# Altium schematic sheet Sheet2.SchDoc
size A
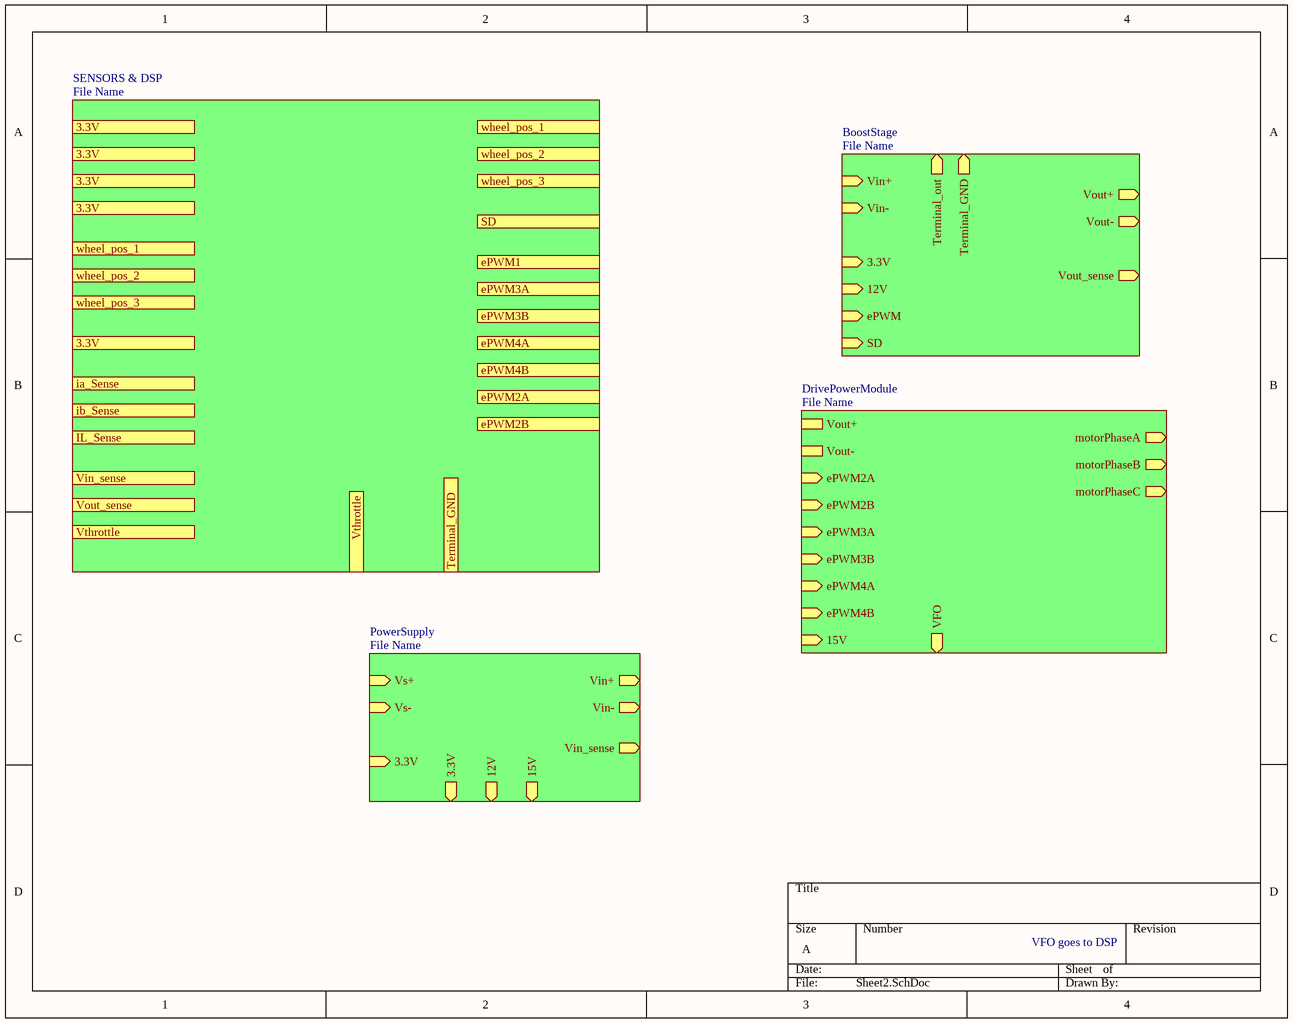
[diagram p0: Sheet2.SchDoc]

## Sub-sheets
BoostStage = File Name: Vin+ (in), Vin- (in), 12V (in), ePWM (in), SD (in), Terminal_out (out), Terminal_GND (out), 3.3V (in), Vout+ (out), Vout- (out), Vout_sense (out)
DrivePowerModule = File Name: ePWM2A (in), ePWM2B (in), ePWM3A (in), ePWM3B (in), ePWM4A (in), ePWM4B (in), motorPhaseB (out), motorPhaseA (out), motorPhaseC (out), 15V (in), VFO (out), Vout+, Vout-
PowerSupply = File Name: Vs+ (in), Vs- (in), Vin+ (out), Vin- (out), 3.3V (out), 12V (out), 15V (out), Vin_sense (out), 3.3V (in)
SENSORS & DSP = File Name: no entries

## Ports
3.3V (in), ePWM1 (out), ePWM2A (out), ePWM2B, ePWM3A (out), ePWM3B (out), ePWM4A (out), ePWM4B (out), ia_Sense (in), ib_Sense (in), IL_Sense (in), SD (out), Terminal_GND (out), Vin_sense (in), Vout_sense (in), Vthrottle (in), Vthrottle (out), wheel_pos_1 (in), wheel_pos_1 (out), wheel_pos_2 (in), wheel_pos_2 (out), wheel_pos_3 (in), wheel_pos_3 (out)

## Notes on the sheet
- VFO goes to DSP